# Altium schematic sheet Analog_8Ch.SchDoc
size A4; Organization: Altium Limited; Address1: L3, 12a Rodborough Rd; Address2: Frenchs Forest; Address3: NSW; Address4: Australia 2086
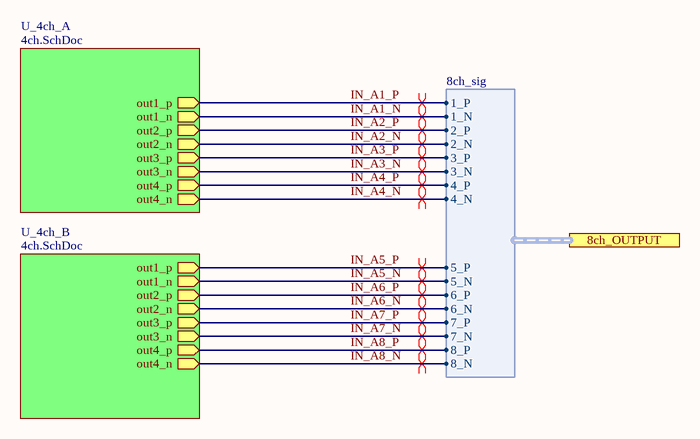
[diagram p0: Analog_8Ch.SchDoc]

## Sub-sheets
U_4ch_A = 4ch.SchDoc: out4_p (out), out1_n (out), out2_p (out), out1_p (out), out2_n (out), out3_n (out), out3_p (out), out4_n (out)
U_4ch_B = 4ch.SchDoc: out4_p (out), out1_n (out), out2_p (out), out1_p (out), out2_n (out), out3_n (out), out3_p (out), out4_n (out)

## Ports
8ch_OUTPUT (harness 8ch_sig)

## Harnesses
8ch_sig: 1_P, 1_N, 2_P, 2_N, 3_P, 3_N, 4_P, 4_N, 5_P, 5_N, 6_P, 6_N, 7_P, 7_N, 8_P, 8_N

## Nets
IN_A1_N: sheet U_4ch_A/out1_n, port 8ch_OUTPUT.1_N
IN_A1_P: sheet U_4ch_A/out1_p, port 8ch_OUTPUT.1_P
IN_A2_N: sheet U_4ch_A/out2_n, port 8ch_OUTPUT.2_N
IN_A2_P: sheet U_4ch_A/out2_p, port 8ch_OUTPUT.2_P
IN_A3_N: sheet U_4ch_A/out3_n, port 8ch_OUTPUT.3_N
IN_A3_P: sheet U_4ch_A/out3_p, port 8ch_OUTPUT.3_P
IN_A4_N: sheet U_4ch_A/out4_n, port 8ch_OUTPUT.4_N
IN_A4_P: sheet U_4ch_A/out4_p, port 8ch_OUTPUT.4_P
IN_A5_N: sheet U_4ch_B/out1_n, port 8ch_OUTPUT.5_N
IN_A5_P: sheet U_4ch_B/out1_p, port 8ch_OUTPUT.5_P
IN_A6_N: sheet U_4ch_B/out2_n, port 8ch_OUTPUT.6_N
IN_A6_P: sheet U_4ch_B/out2_p, port 8ch_OUTPUT.6_P
IN_A7_N: sheet U_4ch_B/out3_n, port 8ch_OUTPUT.7_N
IN_A7_P: sheet U_4ch_B/out3_p, port 8ch_OUTPUT.7_P
IN_A8_N: sheet U_4ch_B/out4_n, port 8ch_OUTPUT.8_N
IN_A8_P: sheet U_4ch_B/out4_p, port 8ch_OUTPUT.8_P

## Layout directives
differential pair: IN_A1_N, IN_A1_P, IN_A2_N, IN_A2_P, IN_A3_N, IN_A3_P, IN_A4_N, IN_A4_P, IN_A5_N, IN_A5_P, IN_A6_N, IN_A6_P, IN_A7_N, IN_A7_P, IN_A8_N, IN_A8_P

## Notes on the sheet
- Project Name:
- Revision:
- File Name:
- Date:
- Nuclear Instruments srl
- Via Lecco, 16, Lambrugo, Italy
- +39 031 2289570
- info@nuclearinstruments.eu
- http://www.nuclearinstruments.eu